# Altium schematic sheet Top.SchDoc
size A4; Organization: TESLA Motors, INC; Address1: 3500 Deer Creek Road; Address2: Palo Alto, CA; Address4: U.S.A.; SheetNumber: 1; SheetTotal: 8
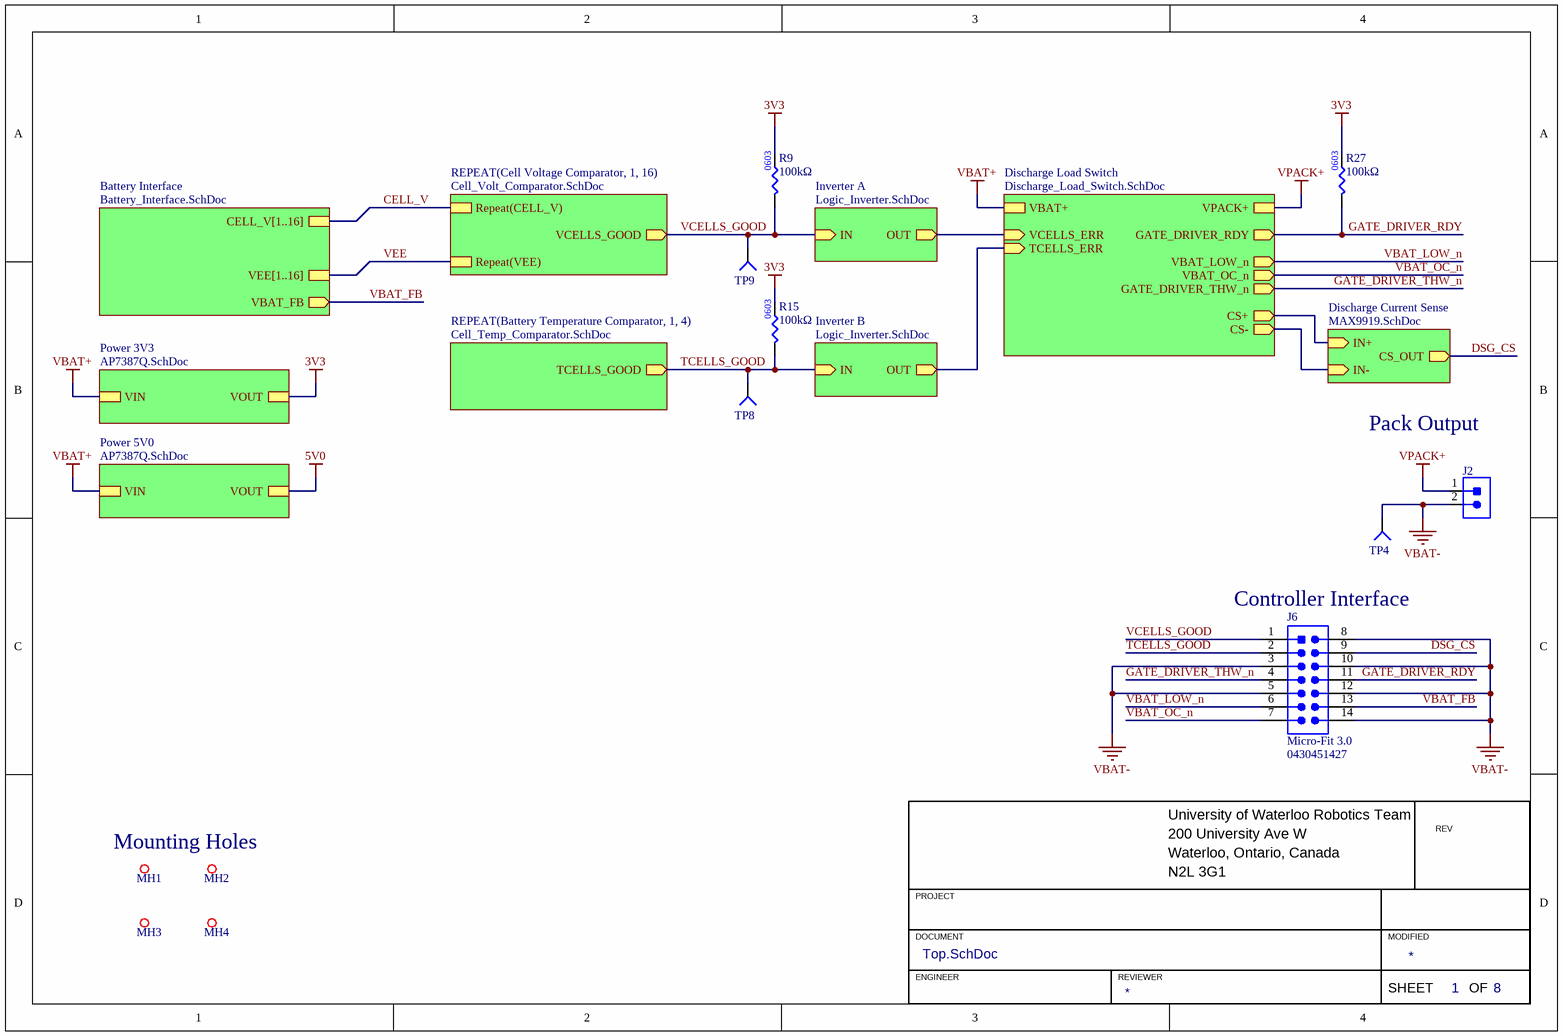
[diagram p0: Top.SchDoc]

## Parts
J2  CON_2POS_XT90  [XT90]  (value not drawn)
J6  Family: Micro-Fit 3.0  [MOLEX-0430451427]  (hidden comment: 0430451427)
MH1  MOUNTING_HOLE_M3  [MOUNTING_HOLE_3mm]  (value not drawn)  (no BOM)
MH2  MOUNTING_HOLE_M3  [MOUNTING_HOLE_3mm]  (value not drawn)  (no BOM)
MH3  MOUNTING_HOLE_M3  [MOUNTING_HOLE_3mm]  (value not drawn)  (no BOM)
MH4  MOUNTING_HOLE_M3  [MOUNTING_HOLE_3mm]  (value not drawn)  (no BOM)
R9  value 100kΩ  [RES0603]  (hidden comment: RES_100kΩ_0603_1%)
R15  value 100kΩ  [RES0603]  (hidden comment: RES_100kΩ_0603_1%)
R27  value 100kΩ  [RES0603]  (hidden comment: RES_100kΩ_0603_1%)
TP4  TESTPOINT_SMD_LOOP  [S1751-46R]  (value not drawn)
TP8  TESTPOINT_1MM_CIRCLE  [TESTPOINT_CIRCLE_1MM]  (value not drawn)  (no BOM)
TP9  TESTPOINT_1MM_CIRCLE  [TESTPOINT_CIRCLE_1MM]  (value not drawn)  (no BOM)

## Sub-sheets
Battery Interface = Battery_Interface.SchDoc: CELL_V[1..16], VEE[1..16], VBAT_FB (out)
Discharge Current Sense = MAX9919.SchDoc: IN+ (in), IN- (in), CS_OUT (out)
Discharge Load Switch = Discharge_Load_Switch.SchDoc: VBAT+, VPACK+, VCELLS_ERR (in), TCELLS_ERR (in), VBAT_LOW_n (out), VBAT_OC_n (out), GATE_DRIVER_THW_n (out), GATE_DRIVER_RDY (out), CS+ (out), CS- (out)
Inverter A = Logic_Inverter.SchDoc: IN (in), OUT (out)
Inverter B = Logic_Inverter.SchDoc: IN (in), OUT (out)
Power 3V3 = AP7387Q.SchDoc: VIN, VOUT
Power 5V0 = AP7387Q.SchDoc: VIN, VOUT
REPEAT(Battery Temperature Comparator, 1, 4) = Cell_Temp_Comparator.SchDoc: TCELLS_GOOD (out)
REPEAT(Cell Voltage Comparator, 1, 16) = Cell_Volt_Comparator.SchDoc: Repeat(CELL_V), Repeat(VEE), VCELLS_GOOD (out)

## Nets
3V3: R9.2 R15.2 R27.2 ; sheet Power 3V3/VOUT
5V0: sheet Power 5V0/VOUT
VBAT+: sheet Power 3V3/VIN, sheet Discharge Load Switch/VBAT+, sheet Power 5V0/VIN
VBAT-: J2.2 J6.3 J6.5 J6.8 J6.10 J6.12 J6.14 TP4.1(=value)
VPACK+: J2.1 ; sheet Discharge Load Switch/VPACK+
CELL_V: sheet REPEAT(Cell Voltage Comparator, 1, 16)/Repeat(CELL_V)
DSG_CS: J6.9 ; sheet Discharge Current Sense/CS_OUT
GATE_DRIVER_RDY: J6.11 R27.1 ; sheet Discharge Load Switch/GATE_DRIVER_RDY
GATE_DRIVER_THW_n: J6.4 ; sheet Discharge Load Switch/GATE_DRIVER_THW_n
TCELLS_GOOD: J6.2 R15.1 TP8.1(=value) ; sheet REPEAT(Battery Temperature Comparator, 1, 4)/TCELLS_GOOD, sheet Inverter B/IN
VBAT_FB: J6.13 ; sheet Battery Interface/VBAT_FB
VBAT_LOW_n: J6.6 ; sheet Discharge Load Switch/VBAT_LOW_n
VBAT_OC_n: J6.7 ; sheet Discharge Load Switch/VBAT_OC_n
VCELLS_GOOD: J6.1 R9.1 TP9.1(=value) ; sheet REPEAT(Cell Voltage Comparator, 1, 16)/VCELLS_GOOD, sheet Inverter A/IN
VEE: sheet REPEAT(Cell Voltage Comparator, 1, 16)/Repeat(VEE)
(unnamed): sheet Discharge Load Switch/VCELLS_ERR, sheet Inverter A/OUT
(unnamed): sheet Discharge Load Switch/TCELLS_ERR, sheet Inverter B/OUT
(unnamed): sheet Discharge Load Switch/CS+, sheet Discharge Current Sense/IN+
(unnamed): sheet Discharge Load Switch/CS-, sheet Discharge Current Sense/IN-

## Notes on the sheet
- Pack Output
- (near J6) Controller Interface
- Mounting Holes
- University of Waterloo Robotics Team
- 200 University Ave W
- REV
- PROJECT
- Waterloo, Ontario, Canada
- N2L 3G1
- DOCUMENT
- ENGINEER
- REVIEWER
- MODIFIED
- SHEET
- OF
- (in symbol RES_100kΩ_0603_1%) 0603

## Library data of the parts
J2 = CON_2POS_XT90: HIGH QUALITY GOLD PLATED XT90 MA; Manufacturer 1: DFRobot; Manufacturer Part Number 1: FIT0588; Mounting Type: TH; Package/Footprint: XT90; Supplier 1: Digi-Key; Supplier Part Number 1: 1738-1438-ND
J6 = CON_MOLEX-HDR_7x2_TH: CONN HEADER VERT 14POS 3MM; Manufacturer 1: Molex; Voltage Rating: 250VAC; Current Rating: 5A; Pitch: 3mm; Supplier 1: Digi-Key; Supplier Part Number 1: WM10707-ND; Manufacturer Part Number 1: 0430451427
R9 R15 R27 = RES_100kΩ_0603_1%: RES 100K OHM 1% 1/10W 0603; Manufacturer 1: Yageo; Manufacturer Part Number 1: RC0603FR-07100KL; Supplier Part Number 1: 311-100KHRCT-ND; Supplier 1: Digi-Key
TP4 = TESTPOINT_SMD_LOOP: TESTPOINT SMD LOOP; Manufacturer 1: Harwin; Supplier 1: Digi-Key; Manufacturer Part Number 1: S1751-46R; Mounting Type: SMD; Package/Footprint: SMD; Supplier Part Number 1: 952-1478-1-ND
TP8 TP9 = TESTPOINT_1MM_CIRCLE: TESTPOINT 1MM CIRCLE